# Altium project STM32F7_ExpansionBoard.PrjPcb (part 2 of 2)

## Sheet Power.SchDoc: Power
size A4; SheetNumber: 1; SheetSize: A4
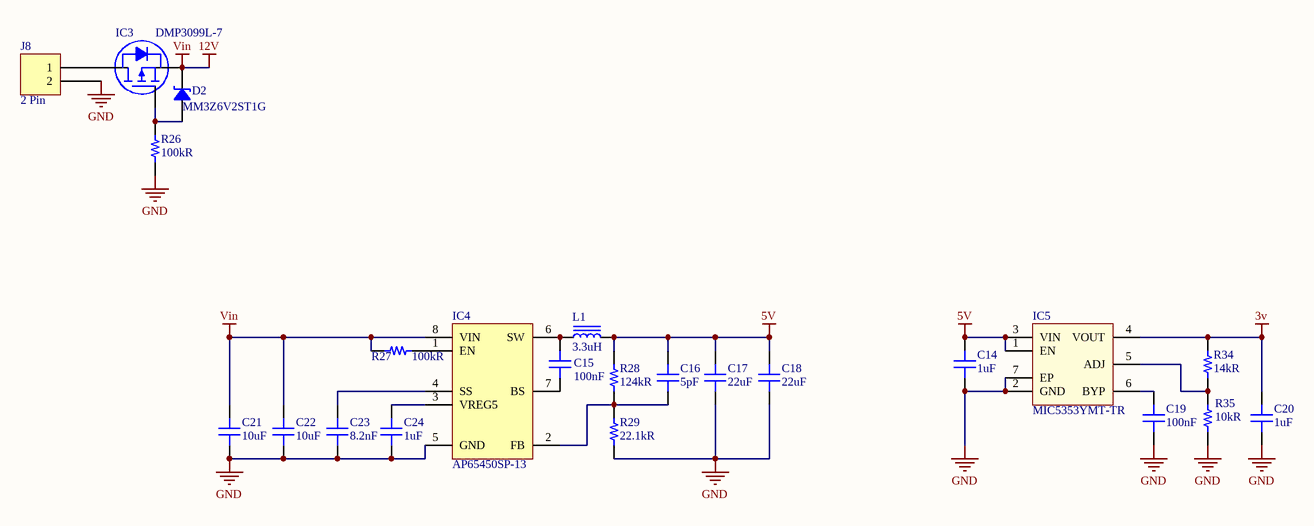
[diagram p3: Power.SchDoc]

### Parts
C14  1uF  [CAP 0603/1608]
C15  100nF  [CAP 0603/1608]
C16  5pF  [CAP 0603/1608]
C17  22uF  [CAP 0603/1608]
C18  22uF  [CAP 0603/1608]
C19  100nF  [CAP 0603/1608]
C20  1uF  [CAP 0603/1608]
C21  10uF  [CAP 0603/1608]
C22  10uF  [CAP 0603/1608]
C23  8.2nF  [CAP 0603/1608]
C24  1uF  [CAP 0603/1608]
D2  MM3Z6V2ST1G  [SOD323]
IC3  DMP3099L-7  [DIODES SOT-23-3]
IC4  AP65450SP-13  [DIODES SO-8EP]
IC5  MIC5353YMT-TR  [MICREL MLF-6 1.6x1.6MM]
J8  2 Pin  [TE 282834-2]  (no BOM)
L1  3.3uH  [MURATA 1264EY-4R7M=P3]
R26  100kR  [RES 0603/1608]
R27  100kR  [RES 0603/1608]
R28  124kR  [RES 0603/1608]
R29  22.1kR  [RES 0603/1608]
R34  14kR  [RES 0603/1608]
R35  10kR  [RES 0603/1608]

### Nets
3v: C20.2 IC5.4(VOUT) R34.2
5V: C14.2 C16.2 C17.2 C18.2 IC5.1(EN) IC5.3(VIN) L1.2 R28.1
12V: C21.2 C22.2 D2.2 IC3.2(S) IC4.8(VIN) R27.1  [also labelled Vin]
GND: C14.1 C17.1 C18.1 C19.1 C20.1 C21.1 C22.1 C23.1 C24.1 IC4.5(GND) IC5.2(GND) IC5.7(EP) J8.2 R26.1 R29.2 R35.2
NetC15_1: C15.1 IC4.6(SW) L1.1
NetC15_2: C15.2 IC4.7(BS)
NetC16_1: C16.1 IC4.2(FB) R28.2 R29.1
NetC19_2: C19.2 IC5.6(BYP)
NetC23_2: C23.2 IC4.4(SS)
NetC24_2: C24.2 IC4.3(VREG5)
NetD2_1: D2.1 IC3.1(G) R26.2
NetIC3_3: IC3.3(D) J8.1
NetIC4_1: IC4.1(EN) R27.2
NetIC5_5: IC5.5(ADJ) R34.1 R35.1

### Notes on the sheet
- Title:
- Size:
- Project:
- Revision:
- Sheet
- of
- Date:
- YıLDıZ IoT
- Elperek Mahallesi
- Saray Sokak, No:12
- SAKARYA / TURKEY
- File:

### Library data of the parts
C14 C20 C24 = Capacitor - Ceramic: Ceramic, SMT Capacitor; Manufacturer: Samsung; Manufacturer Part Number: CL10A105KP8NNNC; Tolerance: 10%; Voltage Rating: 10V; Dielectric: X5R; Supplier 1: Digi-Key; Supplier Part Number 1: 1276-1182-1-ND; Stock 1: 4590831; Pricing 1: 1 = 0,10000, 10 = 0,03800, 100 = 0,01680, 500 = 0,01200, 1000 = 0,00943 (USD); RoHS: Yes; Mount: Surface Mount; Case/Package: 0603; Case Code (Metric): 1608; Case Code (Imperial): 0603; Contact Plating: Tin; Min Operating Temperature: -55°C; Max Operating Temperature: 85°C; Packaging: Tape and Reel; Package Quantity: 1; Capacitance: 1uF; Voltage: 10V; Length: 1.6mm; Height: 0.8mm; Width: 0.031inch; Thickness: 0.035inch; Depth: 0.8mm; Radiation Hardening: No; ComponentLink1URL: https://datasheet.ciiva.com/15195/getdatasheetpartid-358616-15195708.pdf?src-supplier=Verical; ComponentLink1Description: https://datasheet.ciiva.com/15195/getdatasheetpartid-358616-15195708.pdf?src-supplier=Verical; ComponentLink2URL: https://datasheet.ciiva.com/16358/cl05b104kq5nnnc-16358431.pdf?src-supplier=Future+Electronics; ComponentLink2Description: https://datasheet.ciiva.com/16358/cl05b104kq5nnnc-16358431.pdf?src-supplier=Future+Electronics
C15 C19 = Capacitor - Ceramic: Ceramic, SMT Capacitor; Manufacturer: Samsung; Manufacturer Part Number: CL10B104JB8NNNC; Tolerance: 5%; Voltage Rating: 50V; Dielectric: X7R; Supplier 1: Digi-Key; Supplier Part Number 1: 1276-1033-1-ND; Stock 1: 223594; Pricing 1: 1 = 0,10000, 10 = 0,05300, 100 = 0,02350, 500 = 0,01680, 1000 = 0,01320 (USD); RoHS: Yes; Mount: Surface Mount; Case/Package: 0603; Case Code (Metric): 1608; Case Code (Imperial): 0603; Material: Ceramic; Contact Plating: Tin; Min Operating Temperature: -55°C; Max Operating Temperature: 125°C; Packaging: Tape and Reel; Package Quantity: 1; Capacitance: 100nF; Voltage: 50V; Length: 1.6mm; Height: 0.8mm; Width: 0.031inch; Thickness: 0.035inch; Depth: 0.8mm; Radiation Hardening: No; ComponentLink1URL: https://media.digikey.com/pdf/Data%20Sheets/Samsung%20PDFs/CL_Series_MLCC_ds.pdf?src-supplier=Digi-Key; ComponentLink1Description: https://media.digikey.com/pdf/Data%20Sheets/Samsung%20PDFs/CL_Series_MLCC_ds.pdf?src-supplier=Digi-Key; ComponentLink2URL: https://www.verical.com/server-webapp/html/getDatasheet?partID=359321&src-supplier=Verical; ComponentLink2Description: https://www.verical.com/server-webapp/html/getDatasheet?partID=359321&src-supplier=Verical; ComponentLink3URL: http://www1.futureelectronics.com/doc/SAMSUNG/CL10B104JB8NNNC.pdf?src-supplier=Future+Electronics; ComponentLink3Description: http://www1.futureelectronics.com/doc/SAMSUNG/CL10B104JB8NNNC.pdf?src-supplier=Future+Electronics; ComponentLink4URL: https://produktinfo.conrad.com/datenblaetter/450000-474999/456613-da-01-en-VS_KONDENSATOR_0603.pdf?src-supplier=Conrad; ComponentLink4Description: https://produktinfo.conrad.com/datenblaetter/450000-474999/456613-da-01-en-VS_KONDENSATOR_0603.pdf?src-supplier=Conrad
C16 = Capacitor - Ceramic: Ceramic, SMT Capacitor; Manufacturer: Samsung; Manufacturer Part Number: CL10C050BB8NNNC; Voltage Rating: 50V; Dielectric: C0G; Supplier 1: Digi-Key; Supplier Part Number 1: 1276-2129-1-ND; Stock 1: 129045; Pricing 1: 1 = 0,10000, 10 = 0,06800, 100 = 0,03010, 500 = 0,02148, 1000 = 0,01688 (USD); RoHS: Yes; Mount: Surface Mount; Case/Package: 0603; Case Code (Imperial): 0603; Case Code (Metric): 1608; Min Operating Temperature: -55°C; Max Operating Temperature: 125°C; Package Quantity: 1; Packaging: Tape and Reel; Capacitance: 5pF; Length: 1.6mm; Height: 0.8mm; Width: 0.031inch; Thickness: 0.035inch; Depth: 0.8mm; Radiation Hardening: No; ComponentLink1URL: https://datasheet.ciiva.com/25724/cl10c050bb8nnnc-25724229.pdf?src-supplier=Digi-Key; ComponentLink1Description: https://datasheet.ciiva.com/25724/cl10c050bb8nnnc-25724229.pdf?src-supplier=Digi-Key; ComponentLink2URL: https://datasheet.ciiva.com/16214/cl05b104kq5nnnc-16214485.pdf?src-supplier=Future+Electronics; ComponentLink2Description: https://datasheet.ciiva.com/16214/cl05b104kq5nnnc-16214485.pdf?src-supplier=Future+Electronics
C17 C18 = Capacitor - Ceramic: Ceramic, SMT Capacitor; Manufacturer: Samsung; Manufacturer Part Number: CL10A226MPCNUBE; Voltage Rating: 10V; Tolerance: 20%; Supplier 1: Digi-Key; Supplier Part Number 1: 1276-6504-1-ND; Stock 1: 739808; Pricing 1: 1 = 0,38000, 10 = 0,26200, 100 = 0,15740, 500 = 0,11804, 1000 = 0,09967 (USD); RoHS: Yes; Mount: Surface Mount; Case/Package: 0603; Case Code (Metric): 1608; Case Code (Imperial): 0603; Min Operating Temperature: -55°C; Max Operating Temperature: 85°C; Packaging: Tape and Reel; Capacitance: 22uF; Length: 0.063inch; Width: 0.031inch; Thickness: 0.037inch; ComponentLink1URL: http://www.samsungsem.com/kr/support/product-search/mlcc/CL10A226MPCNUBE.jsp?src-supplier=Digi-Key; ComponentLink1Description: http://www.samsungsem.com/kr/support/product-search/mlcc/CL10A226MPCNUBE.jsp?src-supplier=Digi-Key
C21 C22 = Capacitor - Ceramic: Ceramic, SMT Capacitor; Manufacturer: Samsung; Manufacturer Part Number: CL10A106MQ8NNNC; Tolerance: 20%; Voltage Rating: 6.3V; Dielectric: X5R; Supplier 1: Digi-Key; Supplier Part Number 1: 1276-1119-1-ND; Stock 1: 4408315; Pricing 1: 1 = 0,15000, 10 = 0,11000, 100 = 0,05150, 500 = 0,03614, 1000 = 0,02992 (USD); RoHS: Yes; Mount: Surface Mount; Case/Package: 0603; Case Code (Metric): 1608; Case Code (Imperial): 0603; Contact Plating: Tin; Min Operating Temperature: -55°C; Max Operating Temperature: 85°C; Package Quantity: 1; Packaging: Tape and Reel; Capacitance: 10uF; Voltage: 6.3V; Length: 1.6mm; Height: 0.8mm; Width: 0.031inch; Thickness: 0.035inch; Depth: 0.8mm; Radiation Hardening: No; ComponentLink1URL: https://datasheet.ciiva.com/25798/cl10a106mq8nnnc-25798320.pdf?src-supplier=Digi-Key; ComponentLink1Description: https://datasheet.ciiva.com/25798/cl10a106mq8nnnc-25798320.pdf?src-supplier=Digi-Key; ComponentLink2URL: https://datasheet.ciiva.com/26838/getdatasheetpartid-357557-26838347.pdf?src-supplier=Verical; ComponentLink2Description: https://datasheet.ciiva.com/26838/getdatasheetpartid-357557-26838347.pdf?src-supplier=Verical; ComponentLink3URL: https://datasheet.ciiva.com/16437/cl05b104kq5nnnc-16437327.pdf?src-supplier=Future+Electronics; ComponentLink3Description: https://datasheet.ciiva.com/16437/cl05b104kq5nnnc-16437327.pdf?src-supplier=Future+Electronics
C23 = Capacitor - Ceramic: Ceramic, SMT Capacitor; Manufacturer: Walsin Technologies; Manufacturer Part Number: 0603B822K500CT; Dielectric: X7R; Tolerance: 10%; Supplier 1: Digi-Key; Supplier Part Number 1: 1292-1465-1-ND; Stock 1: 48948; Pricing 1: 1 = 0,10000, 10 = 0,04500, 100 = 0,02010, 500 = 0,01436, 1000 = 0,01128 (USD); RoHS: Yes; Case/Package: 0603; Min Operating Temperature: -55°C; Max Operating Temperature: 125°C; Packaging: Tape and Reel; Capacitance: 8.2nF; Length: 1.6mm; Depth: 0.8mm; Radiation Hardening: No; ComponentLink1URL: http://components.arrow.com/part/dataview/0323_00656732?src-supplier=Arrow+Europe; ComponentLink1Description: http://components.arrow.com/part/dataview/0323_00656732?src-supplier=Arrow+Europe; ComponentLink2URL: https://www.verical.com/server-webapp/html/getDatasheet?partID=414331&src-supplier=Verical; ComponentLink2Description: https://www.verical.com/server-webapp/html/getDatasheet?partID=414331&src-supplier=Verical
D2 = MM3Z6V2ST1G: DIODE ZENER 6.2V 300MW SOD323; Manufacturer: ON Semiconductor; Material: Plastic; Element Configuration: Single; Impedance: 10R; Max Reverse Leakage Current: 3uA; Tolerance: 2%; Test Current: 5mA; Max Power Dissipation: 200mW; ESD Protection: Yes; Zener Current: 10mA; Forward Voltage: 900mV; ComponentLink1Description: Datasheet; ComponentLink1URL: https://www.onsemi.com/pub/Collateral/MM3Z2V4ST1-D.PDF; ComponentLink2Description: DigiKey Link; ComponentLink2URL: http://digikey.com/product-detail/en/on-semiconductor/MM3Z6V2ST1G/MM3Z6V2ST1GOSCT-ND/2705115; Supplier 1: Digi-Key; Supplier Part Number 1: MM3Z6V2ST1GOSCT-ND; Manufacturer Part Number: MM3Z6V2ST1G; Stock 1: 67524; Pricing 1: 1 = 0,13000, 10 = 0,11800, 25 = 0,11240, 100 = 0,04950, 250 = 0,04752, 500 = 0,03888, 1000 = 0,02700 (USD); RoHS: Yes; Case/Package: SOD-323-2; Number of Pins: 2; Contact Plating: Tin,Matte; Min Operating Temperature: -65°C; Max Operating Temperature: 150°C; Zener Voltage: 6.2V; Package Quantity: 3000; Packaging: Tape and Reel; Voltage Rating (DC): 6.2V; Power Rating: 200mW; Power Dissipation: 200mW; Voltage Tolerance: 2%; Working Voltage: 6.2V; Peak Reverse Current: 3uA; Length: 1.8mm; Height: 1mm; Width: 1.35mm; Radiation Hardening: No; Lead Free: Lead Free; REACH SVHC: No SVHC; ComponentLink3URL: https://datasheet.ciiva.com/16292/mm3z6v2st1g-16292653.pdf?src-supplier=Future+Electronics; ComponentLink3Description: https://datasheet.ciiva.com/16292/mm3z6v2st1g-16292653.pdf?src-supplier=Future+Electronics; ComponentLink4URL: https://datasheet.ciiva.com/899/mm3z2v4st1-d-899825.pdf?src-supplier=Digi-Key; ComponentLink4Description: https://datasheet.ciiva.com/899/mm3z2v4st1-d-899825.pdf?src-supplier=Digi-Key; ComponentLink5URL: https://datasheet.ciiva.com/899/mm3z2v4st1-d-899826.pdf?src-supplier=Digi-Key; ComponentLink5Description: https://datasheet.ciiva.com/899/mm3z2v4st1-d-899826.pdf?src-supplier=Digi-Key; ComponentLink6URL: https://datasheet.ciiva.com/22626/1878251-22626917.pdf?src-supplier=Element14; ComponentLink6Description: https://datasheet.ciiva.com/22626/1878251-22626917.pdf?src-supplier=Element14; ComponentLink7URL: https://datasheet.ciiva.com/16473/mm3z2v4st1-d-16473527.pdf?src-supplier=Avnet+Asia; ComponentLink7Description: https://datasheet.ciiva.com/16473/mm3z2v4st1-d-16473527.pdf?src-supplier=Avnet+Asia; ComponentLink8URL: https://datasheet.ciiva.com/22626/1878251-22626919.pdf?src-supplier=Element14; ComponentLink8Description: https://datasheet.ciiva.com/22626/1878251-22626919.pdf?src-supplier=Element14; ComponentLink9URL: https://datasheet.ciiva.com/10637/mm3z2v4st1-d-10637848.pdf?src-supplier=Avnet; ComponentLink9Description: https://datasheet.ciiva.com/10637/mm3z2v4st1-d-10637848.pdf?src-supplier=Avnet; ComponentLink10URL: https://datasheet.ciiva.com/899/mm3z2v4st1-d-899827.pdf?src-supplier=Digi-Key; ComponentLink10Description: https://datasheet.ciiva.com/899/mm3z2v4st1-d-899827.pdf?src-supplier=Digi-Key
IC3 = DMP3099L-7: MOSFET P-CH 30V SOT23; Manufacturer: Diodes; Drain to Source Voltage (Vdss): -30V; Number of Channels: 1; Continuous Drain Current (ID): 3.8A; Max Power Dissipation: 1.08W; Turn-On Delay Time: 4.8ns; Turn-Off Delay Time: 31ns; Fall Time: 15ns; Drain to Source Resistance: 65mR; Threshold Voltage: -2.1V; Rise Time: 5ns; Input Capacitance: 563pF; Element Configuration: Single; Gate to Source Voltage (Vgs): 20V; ComponentLink1Description: Datasheet; ComponentLink1URL: https://www.diodes.com/assets/Datasheets/DMP3099L.pdf; ComponentLink2Description: DigiKey Link; ComponentLink2URL: http://digikey.com/product-detail/en/diodes-incorporated/DMP3099L-7/DMP3099L-7DICT-ND/5218217; ComponentLink3URL: http://www.farnell.com/datasheets/2040103.pdf?src-supplier=Farnell; ComponentLink3Description: http://www.farnell.com/datasheets/2040103.pdf?src-supplier=Farnell; ComponentLink4URL: http://www.mouser.com/ds/2/115/DMP3099L-266220.pdf?src-supplier=Mouser; ComponentLink4Description: http://www.mouser.com/ds/2/115/DMP3099L-266220.pdf?src-supplier=Mouser; ComponentLink5URL: http://www.alliedelec.com/m/d/a7453f83181edfde31570147b9d1ef2f.pdf?src-supplier=Allied+Electronics; ComponentLink5Description: http://www.alliedelec.com/m/d/a7453f83181edfde31570147b9d1ef2f.pdf?src-supplier=Allied+Electronics; ComponentLink6URL: http://www.diodes.com/datasheets/DMP3099L.pdf?src-supplier=Avnet; ComponentLink6Description: http://www.diodes.com/datasheets/DMP3099L.pdf?src-supplier=Avnet; ComponentLink7URL: http://www.diodes.com/datasheets/DMP3099L.pdf?src-supplier=Avnet+Asia; ComponentLink7Description: http://www.diodes.com/datasheets/DMP3099L.pdf?src-supplier=Avnet+Asia; ComponentLink8URL: https://www.diodes.com/assets/Datasheets/DMP3099L.pdf?src-supplier=Digi-Key; ComponentLink8Description: https://www.diodes.com/assets/Datasheets/DMP3099L.pdf?src-supplier=Digi-Key; ComponentLink9URL: http://www.farnell.com/datasheets/2040103.pdf?src-supplier=Newark; ComponentLink9Description: http://www.farnell.com/datasheets/2040103.pdf?src-supplier=Newark; ComponentLink10URL: http://www.farnell.com/datasheets/2040103.pdf?src-supplier=Element14; ComponentLink10Description: http://www.farnell.com/datasheets/2040103.pdf?src-supplier=Element14; ComponentLink11URL: http://www.diodes.com/datasheets/DMP3099L.pdf?src-supplier=Digi-Key; ComponentLink11Description: http://www.diodes.com/datasheets/DMP3099L.pdf?src-supplier=Digi-Key; Supplier 1: Digi-Key; Supplier Part Number 1: DMP3099L-7DICT-ND; Manufacturer Part Number: DMP3099L-7; Stock 1: 60343; Pricing 1: 1 = 0,33000, 10 = 0,24200, 25 = 0,21200, 100 = 0,11510, 250 = 0,11452, 500 = 0,09394, 1000 = 0,06969 (USD); RoHS: Yes; Mount: Surface Mount; Case/Package: SOT-23; Number of Pins: 3; Weight: 0.000282oz; Contact Plating: Tin,Matte; Min Operating Temperature: -55°C; Max Operating Temperature: 150°C; Package Quantity: 3000; Packaging: Tape and Reel; Rds On Max: 65mR; Length: 3mm; Height: 1.1mm; Width: 1.4mm; Radiation Hardening: No; REACH SVHC: No SVHC; Lead Free: Lead Free
IC4 = DIODES AP65450: Manufacturer: Diodes; Output Voltage: 6V; Operating Supply Current: 900uA; Min Supply Voltage: 4.5V; Max Output Current: 4A; Output Type: Adjustable; Output Configuration: Positive; Operating Supply Voltage: 18V; Number of Outputs: 1; Min Output Voltage: 760mV; Switching Frequency: 650kHz; Synchronous Rectifier: Yes; Supplier 1: Digi-Key; Supplier Part Number 1: AP65450SP-13DICT-ND; Manufacturer Part Number: AP65450SP-13; Stock 1: 3355; Pricing 1: 1 = 0,83000, 10 = 0,73300, 25 = 0,68880, 100 = 0,52220, 250 = 0,44440, 500 = 0,42218, 1000 = 0,32219 (USD); RoHS: Yes; Mount: Surface Mount; Case/Package: SOIC; Number of Pins: 8; Contact Plating: Tin,Matte; Min Operating Temperature: -40°C; Max Operating Temperature: 85°C; Package Quantity: 2500; Packaging: Tape and Reel; Min Input Voltage: 4.5V; Max Input Voltage: 18V; Max Output Voltage: 6V; Output Current: 4A; Lead Free: Lead Free; ComponentLink1URL: http://www.mouser.com/ds/2/115/AP65450-515037.pdf?src-supplier=Mouser; ComponentLink1Description: http://www.mouser.com/ds/2/115/AP65450-515037.pdf?src-supplier=Mouser; ComponentLink2URL: https://www.diodes.com/assets/Datasheets/AP65450.pdf?src-supplier=Digi-Key; ComponentLink2Description: https://www.diodes.com/assets/Datasheets/AP65450.pdf?src-supplier=Digi-Key; ComponentLink3URL: http://diodes.com/datasheets/AP65450.pdf?src-supplier=Avnet; ComponentLink3Description: http://diodes.com/datasheets/AP65450.pdf?src-supplier=Avnet
IC5 = MICROCHIP MIC5353: Integrated Circuit; ComponentLink1URL: http://www.farnell.com/datasheets/2245202.pdf?src-supplier=Farnell; ComponentLink1Description: http://www.farnell.com/datasheets/2245202.pdf?src-supplier=Farnell; ComponentLink2URL: http://www.microchip.com/mymicrochip/filehandler.aspx?ddocname=en579989&src-supplier=Digi-Key; ComponentLink2Description: http://www.microchip.com/mymicrochip/filehandler.aspx?ddocname=en579989&src-supplier=Digi-Key; ComponentLink3URL: http://www.farnell.com/datasheets/1692673.pdf?src-supplier=Element14; ComponentLink3Description: http://www.farnell.com/datasheets/1692673.pdf?src-supplier=Element14; Supplier 1: Digi-Key; Supplier Part Number 1: 576-3681-1-ND; Manufacturer: Microchip; Manufacturer Part Number: MIC5353YMT-TR; Stock 1: 1004; Pricing 1: 1 = 0,34000, 25 = 0,28000, 100 = 0,26000 (USD); RoHS: Yes; ComponentLink4URL: https://datasheet.ciiva.com/2049/mic5353-2049344.pdf?src-supplier=Digi-Key; ComponentLink4Description: https://datasheet.ciiva.com/2049/mic5353-2049344.pdf?src-supplier=Digi-Key; ComponentLink5URL: https://datasheet.ciiva.com/2049/mic5353-2049342.pdf?src-supplier=Digi-Key; ComponentLink5Description: https://datasheet.ciiva.com/2049/mic5353-2049342.pdf?src-supplier=Digi-Key; ComponentLink6URL: https://datasheet.ciiva.com/2049/mic5353-2049343.pdf?src-supplier=Digi-Key; ComponentLink6Description: https://datasheet.ciiva.com/2049/mic5353-2049343.pdf?src-supplier=Digi-Key
L1 = Inductor Iron Core: Manufacturer: Murata; Manufacturer Part Number: 1264EY-3R3N=P3; Core Material: Ferrite; Tolerance: 30%; Current Rating: 6.5A; Shielding: Shielded; DC Resistance (DCR): 25.2mR; Test Frequency: 100kHz; ComponentLink1URL: http://www.toko.co.jp/products/pdf/inductors/dg6050c.pdf?src-supplier=Avnet; ComponentLink1Description: http://www.toko.co.jp/products/pdf/inductors/dg6050c.pdf?src-supplier=Avnet; ComponentLink2URL: http://www.toko.co.jp/products/pdf/inductors/dg6050c.pdf?src-supplier=Digi-Key; ComponentLink2Description: http://www.toko.co.jp/products/pdf/inductors/dg6050c.pdf?src-supplier=Digi-Key; Supplier 1: Digi-Key; Supplier Part Number 1: 490-10821-1-ND; Stock 1: 442; Pricing 1: 1 = 0,51000, 10 = 0,44300, 100 = 0,31630, 500 = 0,26566 (USD); RoHS: Yes; Mount: Surface Mount; Case/Package: Nonstandard; Packaging: Tape and Reel; Composition: Wirewound; Inductance: 3.3uH; Length: 0.248inch; Width: 0.248inch; Height - Seated (Max): 0.198inch
R26 R27 = Resistor_Chip: Ceramic, SMT Capacitor; Manufacturer: Susumu; Manufacturer Part Number: RR0816P-104-D; Max Power Dissipation: 63mW; Voltage Rating (DC): 75V; Tolerance: 0.5%; Temperature Coefficient: 25ppm/°C; Supplier 1: Digi-Key; Supplier Part Number 1: RR08P100KDCT-ND; Pricing 1: 1 = 0,10000, 10 = 0,09300, 100 = 0,03580, 1000 = 0,01575, 2500 = 0,01360 (USD); RoHS: Yes; Case/Package: 0603; Number of Pins: 2; Case Code (Imperial): 0603; Case Code (Metric): 1608; Min Operating Temperature: -55°C; Max Operating Temperature: 125°C; Power Rating: 63mW; Voltage Rating: 75V; Packaging: Tape and Reel; Resistance: 100kR; Package Quantity: 1; Termination: SMD/SMT; Composition: Thin Film; Number of Terminations: 2; Working Voltage: 75V; Length: 1.6mm; Height: 0.4mm; Width: 0.8mm; Depth: 0.8mm; Lead Free: Lead Free; REACH SVHC: Unknown; ComponentLink1URL: https://datasheet.ciiva.com/11820/0900766b80808d64-11820638.pdf?src-supplier=RSComponents; ComponentLink1Description: https://datasheet.ciiva.com/11820/0900766b80808d64-11820638.pdf?src-supplier=RSComponents; ComponentLink2URL: https://datasheet.ciiva.com/7984/87330-7984341.pdf?src-supplier=Element14; ComponentLink2Description: https://datasheet.ciiva.com/7984/87330-7984341.pdf?src-supplier=Element14; ComponentLink3URL: https://datasheet.ciiva.com/2487/rr-data-sheet-2487067.pdf?src-supplier=Digi-Key; ComponentLink3Description: https://datasheet.ciiva.com/2487/rr-data-sheet-2487067.pdf?src-supplier=Digi-Key; ComponentLink4URL: https://datasheet.ciiva.com/2487/rr-data-sheet-2487068.pdf?src-supplier=Digi-Key; ComponentLink4Description: https://datasheet.ciiva.com/2487/rr-data-sheet-2487068.pdf?src-supplier=Digi-Key; ComponentLink5URL: https://datasheet.ciiva.com/2487/rr-data-sheet-2487069.pdf?src-supplier=Digi-Key; ComponentLink5Description: https://datasheet.ciiva.com/2487/rr-data-sheet-2487069.pdf?src-supplier=Digi-Key
  R26: Stock 1: 70051
  R27: Stock 1: 69727
R28 = Resistor_Chip: Ceramic, SMT Capacitor; Manufacturer: Stackpole Electronics; Manufacturer Part Number: RMCF0603FT124K; Max Power Dissipation: 100mW; Temperature Coefficient: 100ppm/°C; Tolerance: 1%; ComponentLink1URL: https://datasheet.ciiva.com/11820/0900766b80808d64-11820638.pdf?src-supplier=RSComponents; ComponentLink1Description: https://datasheet.ciiva.com/11820/0900766b80808d64-11820638.pdf?src-supplier=RSComponents; ComponentLink2URL: https://datasheet.ciiva.com/7984/87330-7984341.pdf?src-supplier=Element14; ComponentLink2Description: https://datasheet.ciiva.com/7984/87330-7984341.pdf?src-supplier=Element14; ComponentLink3URL: https://datasheet.ciiva.com/2487/rr-data-sheet-2487067.pdf?src-supplier=Digi-Key; ComponentLink3Description: https://datasheet.ciiva.com/2487/rr-data-sheet-2487067.pdf?src-supplier=Digi-Key; ComponentLink4URL: https://datasheet.ciiva.com/2487/rr-data-sheet-2487068.pdf?src-supplier=Digi-Key; ComponentLink4Description: https://datasheet.ciiva.com/2487/rr-data-sheet-2487068.pdf?src-supplier=Digi-Key; ComponentLink5URL: https://datasheet.ciiva.com/2487/rr-data-sheet-2487069.pdf?src-supplier=Digi-Key; ComponentLink5Description: https://datasheet.ciiva.com/2487/rr-data-sheet-2487069.pdf?src-supplier=Digi-Key; Supplier 1: Digi-Key; Supplier Part Number 1: RMCF0603FT124KCT-ND; Stock 1: 39767; Pricing 1: 1 = 0,10000, 10 = 0,01600, 100 = 0,00650, 1000 = 0,00292, 2500 = 0,00253 (USD); RoHS: Yes; Mount: Surface Mount; Case/Package: 0603; Case Code (Metric): 1608; Contact Plating: Tin,Matte; Case Code (Imperial): 0603; Min Operating Temperature: -55°C; Max Operating Temperature: 155°C; Features: Automotive AEC-Q200; Composition: Thick Film; Number of Terminations: 2; Military Standard: Not; Resistance: 124kR; Packaging: Tape and Reel; Length: 0.061inch; Height: 0.022inch; Depth: 0.8mm; Width: 0.031inch; Radiation Hardening: No; ComponentLink6URL: https://www.verical.com/server-webapp/html/getDatasheet?partID=371756&src-supplier=Verical; ComponentLink6Description: https://www.verical.com/server-webapp/html/getDatasheet?partID=371756&src-supplier=Verical; ComponentLink7URL: https://www.seielect.com/Catalog/SEI-RMCF_RMCP.pdf?src-supplier=Digi-Key; ComponentLink7Description: https://www.seielect.com/Catalog/SEI-RMCF_RMCP.pdf?src-supplier=Digi-Key; ComponentLink8URL: https://www.seielect.com/catalog/SEI-Packaging.pdf?src-supplier=Digi-Key; ComponentLink8Description: https://www.seielect.com/catalog/SEI-Packaging.pdf?src-supplier=Digi-Key; ComponentLink9URL: http://components.arrow.com/part/dataview/40961222S9798425N1174?src-supplier=Arrow; ComponentLink9Description: http://components.arrow.com/part/dataview/40961222S9798425N1174?src-supplier=Arrow; ComponentLink10URL: https://www.seielect.com/catalog/SEI-RMCF_RMCP.pdf?src-supplier=Avnet; ComponentLink10Description: https://www.seielect.com/catalog/SEI-RMCF_RMCP.pdf?src-supplier=Avnet
R29 = Resistor_Chip: Ceramic, SMT Capacitor; Manufacturer: Stackpole Electronics; Manufacturer Part Number: RMCF0603FT22K1; Max Power Dissipation: 100mW; Temperature Coefficient: 100ppm/°C; Tolerance: 1%; ComponentLink1URL: https://datasheet.ciiva.com/11820/0900766b80808d64-11820638.pdf?src-supplier=RSComponents; ComponentLink1Description: https://datasheet.ciiva.com/11820/0900766b80808d64-11820638.pdf?src-supplier=RSComponents; ComponentLink2URL: https://datasheet.ciiva.com/7984/87330-7984341.pdf?src-supplier=Element14; ComponentLink2Description: https://datasheet.ciiva.com/7984/87330-7984341.pdf?src-supplier=Element14; ComponentLink3URL: https://datasheet.ciiva.com/2487/rr-data-sheet-2487067.pdf?src-supplier=Digi-Key; ComponentLink3Description: https://datasheet.ciiva.com/2487/rr-data-sheet-2487067.pdf?src-supplier=Digi-Key; ComponentLink4URL: https://datasheet.ciiva.com/2487/rr-data-sheet-2487068.pdf?src-supplier=Digi-Key; ComponentLink4Description: https://datasheet.ciiva.com/2487/rr-data-sheet-2487068.pdf?src-supplier=Digi-Key; ComponentLink5URL: https://datasheet.ciiva.com/2487/rr-data-sheet-2487069.pdf?src-supplier=Digi-Key; ComponentLink5Description: https://datasheet.ciiva.com/2487/rr-data-sheet-2487069.pdf?src-supplier=Digi-Key; Supplier 1: Digi-Key; Supplier Part Number 1: RMCF0603FT22K1CT-ND; Stock 1: 555240; Pricing 1: 1 = 0,10000, 10 = 0,01600, 100 = 0,00650, 1000 = 0,00292, 2500 = 0,00253 (USD); RoHS: Yes; Mount: Surface Mount; Case/Package: 0603; Contact Plating: Tin,Matte; Case Code (Imperial): 0603; Case Code (Metric): 1608; Min Operating Temperature: -55°C; Max Operating Temperature: 155°C; Features: Automotive AEC-Q200; Package Quantity: 1; Composition: Thick Film; Number of Terminations: 2; Military Standard: Not; Packaging: Tape and Reel; Resistance: 22.1kR; Power Rating: 100mW; Length: 0.061inch; Height: 0.022inch; Depth: 0.8mm; Width: 0.031inch; Radiation Hardening: No; Lead Free: Lead Free; ComponentLink6URL: http://components.arrow.com/part/dataview/40960961S7171997N1174?src-supplier=Arrow; ComponentLink6Description: http://components.arrow.com/part/dataview/40960961S7171997N1174?src-supplier=Arrow; ComponentLink7URL: https://www.verical.com/server-webapp/html/getDatasheet?partID=375344&src-supplier=Verical; ComponentLink7Description: https://www.verical.com/server-webapp/html/getDatasheet?partID=375344&src-supplier=Verical; ComponentLink8URL: https://www.seielect.com/catalog/SEI-Packaging.pdf?src-supplier=Digi-Key; ComponentLink8Description: https://www.seielect.com/catalog/SEI-Packaging.pdf?src-supplier=Digi-Key; ComponentLink9URL: https://www.seielect.com/Catalog/SEI-RMCF_RMCP.pdf?src-supplier=Digi-Key; ComponentLink9Description: https://www.seielect.com/Catalog/SEI-RMCF_RMCP.pdf?src-supplier=Digi-Key; ComponentLink10URL: https://www.seielect.com/catalog/SEI-RMCF_RMCP.pdf?src-supplier=Avnet; ComponentLink10Description: https://www.seielect.com/catalog/SEI-RMCF_RMCP.pdf?src-supplier=Avnet; ComponentLink11URL: http://www.seielect.com/Catalog/SEI-RMC.pdf?src-supplier=Future+Electronics; ComponentLink11Description: http://www.seielect.com/Catalog/SEI-RMC.pdf?src-supplier=Future+Electronics
R34 = Resistor_Chip: Ceramic, SMT Capacitor; Manufacturer: Yageo; Manufacturer Part Number: RC0603FR-0714KL; Tolerance: 1%; Power Rating: 100mW; Voltage Rating: 75V; Temperature Coefficient: 100ppm/°C; Voltage Rating (DC): 50V; Supplier 1: Digi-Key; Supplier Part Number 1: 311-14.0KHRCT-ND; Stock 1: 622097; Pricing 1: 1 = 0,10000, 10 = 0,02300, 100 = 0,00940, 1000 = 0,00421, 2500 = 0,00366 (USD); RoHS: Yes; Case/Package: 0603; Weight: 7.1E-05oz; Case Code (Metric): 1608; Case Code (Imperial): 0603; Min Operating Temperature: -55°C; Max Operating Temperature: 155°C; Resistance: 14kR; Packaging: Tape and Reel; Package Quantity: 1; Max Power Dissipation: 100mW; Features: Moisture Resistant; Composition: Thick Film; Number of Terminations: 2; Termination: SMD/SMT; Military Standard: Not; Length: 1.6mm; Height: 0.022inch; Width: 0.031inch; Depth: 0.8mm; Lead Free: Lead Free; ComponentLink1URL: https://datasheet.ciiva.com/15189/getdatasheetpartid-325152-15189610.pdf?src-supplier=Verical; ComponentLink1Description: https://datasheet.ciiva.com/15189/getdatasheetpartid-325152-15189610.pdf?src-supplier=Verical; ComponentLink2URL: https://datasheet.ciiva.com/2455/pyu-r-int-thick-7-2455089.pdf?src-supplier=Digi-Key; ComponentLink2Description: https://datasheet.ciiva.com/2455/pyu-r-int-thick-7-2455089.pdf?src-supplier=Digi-Key; ComponentLink3URL: https://datasheet.ciiva.com/2455/pyu-r-int-thick-7-2455090.pdf?src-supplier=Digi-Key; ComponentLink3Description: https://datasheet.ciiva.com/2455/pyu-r-int-thick-7-2455090.pdf?src-supplier=Digi-Key; ComponentLink4URL: https://datasheet.ciiva.com/2455/pyu-r-int-thick-7-2455091.pdf?src-supplier=Digi-Key; ComponentLink4Description: https://datasheet.ciiva.com/2455/pyu-r-int-thick-7-2455091.pdf?src-supplier=Digi-Key
R35 = Resistor_Chip: Ceramic, SMT Capacitor; Manufacturer: Stackpole Electronics; Manufacturer Part Number: RNCP0603FTD10K0; Tolerance: 1%; Max Power Dissipation: 125mW; Temperature Coefficient: 100ppm/°C; Supplier 1: Digi-Key; Supplier Part Number 1: RNCP0603FTD10K0CT-ND; Stock 1: 183083; Pricing 1: 1 = 0,10000, 10 = 0,06700, 100 = 0,02730, 1000 = 0,01224, 2500 = 0,01063 (USD); RoHS: Yes; Mount: Surface Mount; Case/Package: 0603; Case Code (Metric): 1608; Case Code (Imperial): 0603; Contact Plating: Matte,Tin; Min Operating Temperature: -55°C; Max Operating Temperature: 155°C; Packaging: Tape and Reel; Resistance: 10kR; Composition: Thin Film; Number of Terminations: 2; Features: Anti-Sulfur,Moisture Resistant; Length: 0.059inch; Height: 0.02inch; Width: 0.031inch; Radiation Hardening: No; Lead Free: Lead Free

## Sheet RS485.SchDoc: RS485
size A4; Revision: 1; SheetNumber: 7; SheetSize: A4
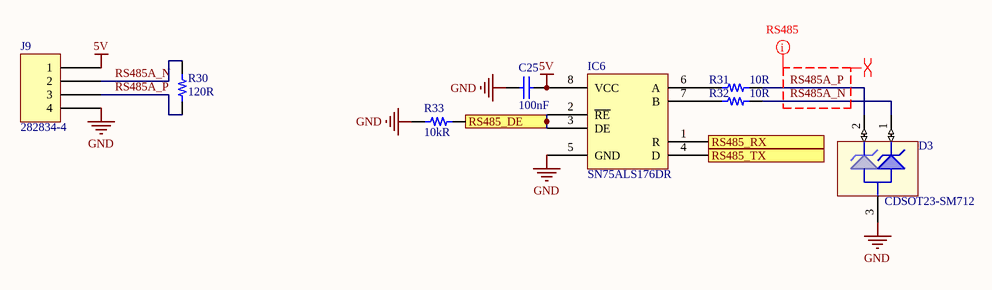
[diagram p4: RS485.SchDoc]

### Parts
C25  100nF  [CAP 0603/1608]
D3  CDSOT23-SM712  [sc70-3]
IC6  SN75ALS176DR  [TI SOIC-8 D]
J9  282834-4  [TE 282834-4]  (no BOM)
R30  120R  [RES 0603/1608]
R31  10R  [RES 0603/1608]
R32  10R  [RES 0603/1608]
R33  10kR  [RES 0603/1608]

### Ports
RS485_DE (in), RS485_RX (out), RS485_TX (in)

### Nets
5V: C25.2 IC6.8(VCC) J9.1
GND: C25.1 D3.3 IC6.5(GND) J9.4 R33.2
RS485A_N: D3.1 J9.2 R30.2 R32.2
RS485A_P: D3.2 J9.3 R30.1 R31.2
NetA1_11: IC6.4(D) ; port RS485_TX
NetA1_13: IC6.1(R) ; port RS485_RX
NetA1_15: IC6.2(~{RE}) IC6.3(DE) R33.1 ; port RS485_DE
NetIC6_6: IC6.6(A) R31.1
NetIC6_7: IC6.7(B) R32.1

### Layout directives
differential pair; differential pair class RS485A: RS485A_N, RS485A_P
net class RS485A: RS485A_N, RS485A_P

### Notes on the sheet
- Title:
- Size:
- Project:
- Revision:
- Sheet
- of
- Date:
- YıLDıZ IoT
- Elperek Mahallesi
- Saray Sokak, No:12
- SAKARYA / TURKEY
- File:

### Library data of the parts
C25 = Cap - Ceramic: Capacitor, Ceramic; Manufacturer: Samsung; Manufacturer Part Number: CL10A104KA8NNNC; Tolerance: 10%; Voltage Rating: 25V; Dielectric: X5R; Supplier 1: Digi-Key; Supplier Part Number 1: 1276-1857-1-ND; Stock 1: 978306; Pricing 1: 1 = 0,10000, 10 = 0,04600, 100 = 0,02070, 500 = 0,01478, 1000 = 0,01162 (USD); RoHS: Yes; Mount: Surface Mount; Case/Package: 0603; Case Code (Metric): 1608; Case Code (Imperial): 0603; Contact Plating: Tin; Min Operating Temperature: -55°C; Max Operating Temperature: 85°C; Package Quantity: 1; Packaging: Tape and Reel; Capacitance: 100nF; Voltage Rating (DC): 25V; Termination: Wraparound; Length: 0.063inch; Width: 0.031inch; Thickness: 0.035inch; Lead Free: Lead Free; ComponentLink1URL: http://www.samsungsem.com/kr/support/library/product-catalog/mlcc.jsp; ComponentLink1Description: http://www.samsungsem.com/kr/support/library/product-catalog/mlcc.jsp; Price: 0,1
D3 = TVS Array: Dual-line Transil™,  transient voltage suppressor (TVS); Manufacturer: Bourns; Direction: Bidirectional; Capacitance: 75pF; Max Surge Current: 30A; Number of Elements: 2; Reverse Breakdown Voltage: 13.3V; Polarity: Bidirectional,Unidirectional; Clamping Voltage: 26V; Max Power Dissipation: 600W; Working Voltage: 12V; Peak Pulse Power: 400W; Power Line Protection: No; Leakage Current: 20uA; ESD Protection: Yes; Peak Pulse Current: 17A; Test Current: 1mA; Element Configuration: Dual; Supplier 1: Digi-Key; Supplier Part Number 1: CDSOT23-SM712CT-ND; Manufacturer Part Number: CDSOT23-SM712; Stock 1: 158124; Pricing 1: 1 = 1,70000, 10 = 1,50900, 25 = 1,36280, 100 = 1,19240, 250 = 1,04636, 500 = 0,92468, 1000 = 0,73001 (USD); RoHS: Yes; Mount: Surface Mount; Case/Package: SOT-23; Number of Pins: 3; Contact Plating: Tin; Min Operating Temperature: -55°C; Max Operating Temperature: 150°C; Packaging: Tape and Reel; Package Quantity: 1; Number of Channels: 2; Breakdown Voltage: 13.3V; Termination: SMD/SMT; Number of Bidirectional Channels: 2; Reverse Standoff Voltage: 12V; Min Breakdown Voltage: 13.3V; Power Dissipation: 400W; Max Reverse Leakage Current: 20uA; Max Breakdown Voltage: 13.3V; Composition: Zener; Length: 3.04mm; Height: 1.11mm; Width: 0.055inch; Depth: 1.4mm; Radiation Hardening: No; REACH SVHC: No SVHC; ComponentLink1URL: http://www.farnell.com/datasheets/2645121.pdf; ComponentLink1Description: http://www.farnell.com/datasheets/2645121.pdf; ComponentLink2URL: http://www.bourns.com/docs/Product-Datasheets/CDSOT23-SM712.pdf; ComponentLink2Description: http://www.bourns.com/docs/Product-Datasheets/CDSOT23-SM712.pdf; ComponentLink3URL: https://www.bourns.com/docs/technical-documents/technical-library/circuit-protection/design-notes/bourns_rs485_evalboard4_design_note.pdf; ComponentLink3Description: https://www.bourns.com/docs/technical-documents/technical-library/circuit-protection/design-notes/bourns_rs485_evalboard4_design_note.pdf; ComponentLink4URL: http://www.farnell.com/datasheets/1670933.pdf; ComponentLink4Description: http://www.farnell.com/datasheets/1670933.pdf
IC6 = SN65HVD78DR: IC TRANSCEIVER HALF 1/1 8SOIC; Manufacturer: Texas Instruments; Data Rate: 35Mbps; Max Supply Voltage: 5.25V; Min Supply Voltage: 4.75V; Number of Drivers: 1; Operating Supply Current: 30mA; Simplex/Duplex: Half Duplex; ESD Protection: No; Operating Supply Voltage: 5V; ComponentLink1Description: Datasheet; ComponentLink1URL: http://www.ti.com/general/docs/suppproductinfo.tsp?distId=10&gotoUrl=http%3A%2F%2Fwww.ti.com%2Flit%2Fgpn%2Fsn65hvd78; ComponentLink2Description: DigiKey Link; ComponentLink2URL: http://digikey.com/product-detail/en/texas-instruments/SN65HVD78DR/296-36714-1-ND/4341340; ComponentLink3URL: https://datasheet.ciiva.com/26837/sn75als176dr-26837272.pdf?src-supplier=IIIC; ComponentLink3Description: https://datasheet.ciiva.com/26837/sn75als176dr-26837272.pdf?src-supplier=IIIC; ComponentLink4URL: https://datasheet.ciiva.com/14427/sn75als176a-14427911.pdf?src-supplier=Avnet; ComponentLink4Description: https://datasheet.ciiva.com/14427/sn75als176a-14427911.pdf?src-supplier=Avnet; ComponentLink5URL: https://datasheet.ciiva.com/1703/sn65als176-1703130.pdf?src-supplier=Digi-Key; ComponentLink5Description: https://datasheet.ciiva.com/1703/sn65als176-1703130.pdf?src-supplier=Digi-Key; ComponentLink6URL: https://datasheet.ciiva.com/1703/sn65als176-1703132.pdf?src-supplier=Digi-Key; ComponentLink6Description: https://datasheet.ciiva.com/1703/sn65als176-1703132.pdf?src-supplier=Digi-Key; ComponentLink7URL: https://datasheet.ciiva.com/1703/sn65als176-1703131.pdf?src-supplier=Digi-Key; ComponentLink7Description: https://datasheet.ciiva.com/1703/sn65als176-1703131.pdf?src-supplier=Digi-Key; ComponentLink8URL: https://datasheet.ciiva.com/48707/001048080-da-01-en-ic-dff-bus-tvr-s-sn75als176dr-soic-8-tid-48707959.pdf?src-supplier=Conrad; ComponentLink8Description: https://datasheet.ciiva.com/48707/001048080-da-01-en-ic-dff-bus-tvr-s-sn75als176dr-soic-8-tid-48707959.pdf?src-supplier=Conrad; Supplier 1: Digi-Key; Supplier Part Number 1: 296-14966-1-ND; Manufacturer Part Number: SN75ALS176DR; Stock 1: 2500; Pricing 1: 1 = 0,99000, 10 = 0,88500, 25 = 0,84000, 100 = 0,69000, 250 = 0,64500, 500 = 0,57000, 1000 = 0,45000 (USD); RoHS: Yes; Case/Package: D; Number of Pins: 8; Weight: 0.002561oz; Contact Plating: Gold; Min Operating Temperature: 0°C; Max Operating Temperature: 70°C; Logic Function: Transceiver; Number of Transceivers: 1; Max Supply Current: 30mA; Number of Receivers: 1; Number of Transmitters: 1; Nominal Supply Current: 30mA; Packaging: Tape and Reel; Package Quantity: 1; Length: 4.9mm; Height: 1.58mm; Width: 3.91mm; Radiation Hardening: No; Lead Free: Lead Free
J9 = 282834-4: TERM BLK 4P SIDE ENT 2.54MM PCB; Manufacturer: TE Connectivity AMP Connectors; Current: 10A; Mating Orientation: Horizontal with Board; Number of Levels: 1; Pitch: 0.100" (2.54mm); Positions Per Level: 4; Voltage: 150V; Wire Gauge: 16-30 AWG; Wire Termination: Screw - Rising Cage Clamp; Part Number: 282834-4; Color: Green; ComponentLink1Description: Datasheet; ComponentLink1URL: https://www.te.com/commerce/DocumentDelivery/DDEController?Action=srchrtrv&DocNm=282834&DocType=Customer+Drawing&DocLang=English; ComponentLink2Description: DigiKey Link; ComponentLink2URL: http://digikey.com/product-detail/en/te-connectivity-amp-connectors/282834-4/A98335-ND/1153265; LastUpdated: 15.01.2020 04:16:05; Lifecycle Status: Active; Minimum Order: 1; Mounting Type: Through Hole; Packaging: Bulk; Part Status: Active; Price: 2.68; Series: Buchanan; Supplier 1: DigiKey; Supplier Part Number 1: A98335-ND
R30 = Resistor_Chip: Ceramic, SMT Capacitor; Manufacturer: Susumu; Manufacturer Part Number: RR0816P-121-D; Power Rating: 63mW; Tolerance: 0.5%; Voltage Rating: 75V; Temperature Coefficient: 25ppm/°C; Supplier 1: Digi-Key; Supplier Part Number 1: RR08P120DCT-ND; Stock 1: 6882; Pricing 1: 1 = 0,11000, 10 = 0,09800, 100 = 0,03760, 1000 = 0,01654, 2500 = 0,01428 (USD); RoHS: Yes; Case/Package: 0603; Number of Pins: 2; Case Code (Metric): 1608; Case Code (Imperial): 0603; Min Operating Temperature: -55°C; Max Operating Temperature: 125°C; Package Quantity: 1; Resistance: 120R; Packaging: Tape and Reel; Composition: Thin Film; Number of Terminations: 2; Termination: SMD/SMT; Max Power Dissipation: 63mW; Voltage Rating (DC): 75V; Length: 0.063inch; Height: 0.02inch; Width: 0.032inch; Depth: 0.8mm; Height - Seated (Max): 0.02inch; REACH SVHC: Unknown; Lead Free: Lead Free; ComponentLink1URL: http://www.susumu.co.jp/common/pdf/n_catalog_partition05_en.pdf; ComponentLink1Description: http://www.susumu.co.jp/common/pdf/n_catalog_partition05_en.pdf; ComponentLink2URL: http://documents.rs-components.com/techlib://itc_doclist_GB.htm?stockno=4744287; ComponentLink2Description: http://documents.rs-components.com/techlib://itc_doclist_GB.htm?stockno=4744287
R31 R32 = Resistor_Chip: Ceramic, SMT Capacitor; Manufacturer: Rohm; Manufacturer Part Number: ESR03EZPJ100; Supplier 1: Digi-Key; Supplier Part Number 1: RHM10DCT-ND; Stock 1: 70067; Pricing 1: 1 = 0,10000, 10 = 0,08700, 100 = 0,03330, 1000 = 0,01464, 2500 = 0,01264 (USD); RoHS: Yes; Case/Package: 0603; Resistance: 10R
R33 = Resistor_Chip: as R35 on sheet Power; Supplier 1: Digi-Key; Supplier Part Number 1: RNCP0603FTD10K0CT-ND; Stock 1: 183083; Pricing 1: 1 = 0,10000, 10 = 0,06700, 100 = 0,02730, 1000 = 0,01224, 2500 = 0,01063 (USD); RoHS: Yes; Mount: Surface Mount; Case/Package: 0603; Case Code (Metric): 1608; Case Code (Imperial): 0603; Contact Plating: Matte,Tin; Min Operating Temperature: -55°C; Max Operating Temperature: 155°C; Packaging: Tape and Reel; Resistance: 10kR; Composition: Thin Film; Number of Terminations: 2; Features: Anti-Sulfur,Moisture Resistant; Length: 0.059inch; Height: 0.02inch; Width: 0.031inch; Radiation Hardening: No; Lead Free: Lead Free

## Sheet Expansion.SchDoc: Expansion
size A4; SheetNumber: 3; SheetSize: A4
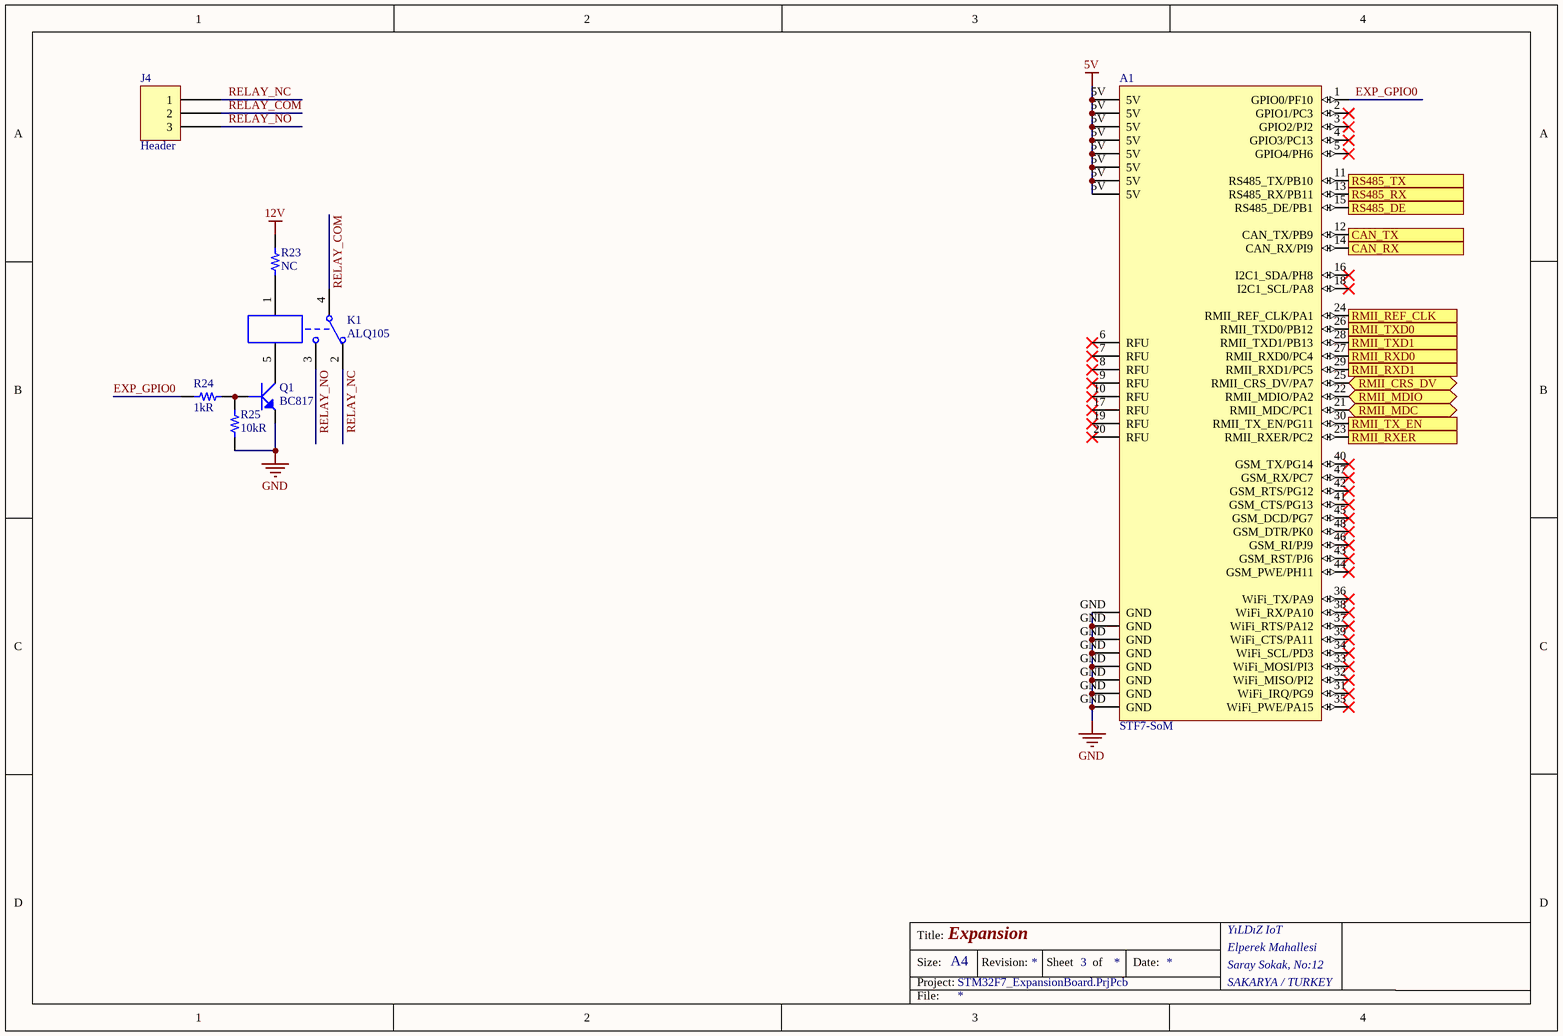
[diagram p5: Expansion.SchDoc]

### Parts
A1  STF7-SoM  [STF7-SoM]
J4  Header  [TE 282834-3]  (no BOM)
K1  ALQ105  [ALQ105]
Q1  BC817  [SOT23-3]  (no BOM)
R23  NC  [RES 0603/1608]  (no BOM)
R24  1kR  [RES 0603/1608]
R25  10kR  [RES 0603/1608]

### Ports
CAN_RX (in), CAN_TX (out), RMII_CRS_DV (bidir), RMII_MDC (bidir), RMII_MDIO (bidir), RMII_REF_CLK (in), RMII_RXD0 (out), RMII_RXD1 (out), RMII_RXER (out), RMII_TX_EN (in), RMII_TXD0 (in), RMII_TXD1 (in), RS485_DE (out), RS485_RX (in), RS485_TX (out)

### Nets
5V: A1.5V
12V: R23.2
GND: A1.GND Q1.2(E) R25.2
EXP_GPIO0: A1.1(GPIO0/PF10) R24.2
RELAY_COM: J4.2 K1.4(COM)
RELAY_NC: J4.1 K1.2(NC)
RELAY_NO: J4.3 K1.3(NO)
RMII_CRS_DV: A1.25(RMII_CRS_DV/PA7) ; port RMII_CRS_DV
RMII_MDC: A1.21(RMII_MDC/PC1) ; port RMII_MDC
RMII_MDIO: A1.22(RMII_MDIO/PA2) ; port RMII_MDIO
RMII_REF_CLK: A1.24(RMII_REF_CLK/PA1) ; port RMII_REF_CLK
RMII_RXD0: A1.27(RMII_RXD0/PC4) ; port RMII_RXD0
RMII_RXD1: A1.29(RMII_RXD1/PC5) ; port RMII_RXD1
RMII_RXER: A1.23(RMII_RXER/PC2) ; port RMII_RXER
RMII_TX_EN: A1.30(RMII_TX_EN/PG11) ; port RMII_TX_EN
RMII_TXD0: A1.26(RMII_TXD0/PB12) ; port RMII_TXD0
RMII_TXD1: A1.28(RMII_TXD1/PB13) ; port RMII_TXD1
NetA1_11: A1.11(RS485_TX/PB10) ; port RS485_TX
NetA1_12: A1.12(CAN_TX/PB9) ; port CAN_TX
NetA1_13: A1.13(RS485_RX/PB11) ; port RS485_RX
NetA1_14: A1.14(CAN_RX/PI9) ; port CAN_RX
NetA1_15: A1.15(RS485_DE/PB1) ; port RS485_DE
NetK1_1: K1.1(COIL) R23.1
NetK1_5: K1.5(COIL) Q1.3(C)
NetQ1_1: Q1.1(B) R24.1 R25.1

Not connected (* = marked no-connect by the designer): A1 2(GPIO1/PC3)* 3(GPIO2/PJ2)* 4(GPIO3/PC13)* 5(GPIO4/PH6)* 6(RFU)* 7(RFU)* 8(RFU)* 9(RFU)* 10(RFU)* 16(I2C1_SDA/PH8)* 17(RFU)* 18(I2C1_SCL/PA8)* 19(RFU)* 20(RFU)* 31(WiFi_IRQ/PG9)* 32(WiFi_MISO/PI2)* 33(WiFi_MOSI/PI3)* 34(WiFi_SCL/PD3)* 35(WiFi_PWE/PA15)* 36(WiFi_TX/PA9)* 37(WiFi_RTS/PA12)* 38(WiFi_RX/PA10)* 39(WiFi_CTS/PA11)* 40(GSM_TX/PG14)* 41(GSM_CTS/PG13)* 42(GSM_RTS/PG12)* 43(GSM_RST/PJ6)* 44(GSM_PWE/PH11)* 45(GSM_DCD/PG7)* 46(GSM_RI/PJ9)* 47(GSM_RX/PC7)* 48(GSM_DTR/PK0)*

### Notes on the sheet
- Title:
- Size:
- Project:
- Revision:
- Sheet
- of
- Date:
- YıLDıZ IoT
- Elperek Mahallesi
- Saray Sokak, No:12
- SAKARYA / TURKEY
- File:

### Library data of the parts
A1 = STF7-SoM: STM32F7 System On Module; Manufacturer Part Number: STF7-SoM
J4 = 3 Pin
K1 = Relay SPDT: Relay or Contactor; Manufacturer: Panasonic; Coil Voltage (DC): 5V; Coil Type: Non-Latching; Relay Type: General Purpose; Throw Configuration: SPDT; Coil Resistance: 62.5R; Coil Current: 80mA; Operate Time: 20ms; Coil Power: 400mW; Max Voltage Rating (AC): 250V; Contact Current Rating: 10A; Supplier 1: Digi-Key; Supplier Part Number 1: 255-3565-ND; Manufacturer Part Number: ALQ105; Stock 1: 8117; Pricing 1: 1 = 1,22000, 10 = 1,14800, 25 = 1,02000, 50 = 0,96900, 100 = 0,91800, 250 = 0,81600, 500 = 0,76500, 1000 = 0,71400, 5000 = 0,68850 (USD); RoHS: Yes; Number of Pins: 5; Weight: 7g; Contact Material: Silver; Min Operating Temperature: -40°C; Max Operating Temperature: 85°C; Termination: PC Pin; Release Time: 20ms; Package Quantity: 100; Packaging: Carton; Power Rating: 400mW; Power Consumption: 400mW; Voltage Rating (AC): 250V; Length: 20mm; Height: 16mm; Depth: 10mm; Width: 10mm; Lead Free: Lead Free; REACH SVHC: Unknown; ComponentLink1URL: http://www.mouser.com/ds/2/315/lq-catalog-1075796.pdf?src-supplier=Mouser; ComponentLink1Description: http://www.mouser.com/ds/2/315/lq-catalog-1075796.pdf?src-supplier=Mouser; ComponentLink2URL: http://www.farnell.com/datasheets/2245159.pdf?src-supplier=Farnell; ComponentLink2Description: http://www.farnell.com/datasheets/2245159.pdf?src-supplier=Farnell; ComponentLink3URL: http://components.arrow.com/part/dataview/0323_06571492?src-supplier=Arrow+Europe; ComponentLink3Description: http://components.arrow.com/part/dataview/0323_06571492?src-supplier=Arrow+Europe; ComponentLink4URL: http://www.alliedelec.com/m/d/b3e6213128df2023f710f2e9cac83292.pdf?src-supplier=Allied+Electronics; ComponentLink4Description: http://www.alliedelec.com/m/d/b3e6213128df2023f710f2e9cac83292.pdf?src-supplier=Allied+Electronics; ComponentLink5URL: https://media.digikey.com/pdf/Data%20Sheets/Panasonic%20Electric%20Works%20PDFs/ALQ(LQ)Relays_NewProdIntro.pdf?src-supplier=Digi-Key; ComponentLink5Description: https://media.digikey.com/pdf/Data%20Sheets/Panasonic%20Electric%20Works%20PDFs/ALQ(LQ)Relays_NewProdIntro.pdf?src-supplier=Digi-Key; ComponentLink6URL: http://www.farnell.com/datasheets/1972641.pdf?src-supplier=Element14; ComponentLink6Description: http://www.farnell.com/datasheets/1972641.pdf?src-supplier=Element14; ComponentLink7URL: http://www.farnell.com/datasheets/2245159.pdf?src-supplier=Newark; ComponentLink7Description: http://www.farnell.com/datasheets/2245159.pdf?src-supplier=Newark
Q1 = BC817: Transistor, BC817; Manufacturer: ON Semiconductor; Manufacturer Part Number: BC817-16LT1G; Transistor Type: NPN; Vce Saturation (Max) @ Ib, Ic: 700mV @ 50mA, 500mA; Current - Collector Cutoff (Max): 100nA (ICBO); DC Current Gain (hFE) (Min) @ Ic, Vce: 100 @ 100mA, 1V; Frequency - Transition: 100MHz; Supplier 1: Digi-Key; Supplier Part Number 1: BC817-16LT1GOSCT-ND; RoHS: RoHS Compliant; Category: Discrete Semiconductor Products; Stock 1: 46603; Pricing 1: 1=0.13, 10=0.118, 100=0.0642, 500=0.0395, 1000=0.02693 (USD); Packaging: Cut Tape (CT); Part Status: Active; Operating Temperature: -65°C ~ 150°C (TJ); Mounting Type: Surface Mount; Package / Case: TO-236-3, SC-59, SOT-23-3; Supplier Device Package: SOT-23-3 (TO-236); Base Part Number: BC817; ComponentLink1URL: http://www.onsemi.com/pub/Collateral/BC817-16LT1-D.PDF; ComponentLink1Description: http://www.onsemi.com/pub/Collateral/BC817-16LT1-D.PDF; Price: 0,13
R23 = Resistor_Chip: Ceramic, SMT Capacitor; Resistance: NC
R24 = Resistor_Chip: Ceramic, SMT Capacitor; Manufacturer: Rohm; Manufacturer Part Number: ESR03EZPJ102; Tolerance: 5%; Temperature Coefficient: 200ppm/°C; Max Power Dissipation: 250mW; Supplier 1: Digi-Key; Supplier Part Number 1: RHM1.0KDCT-ND; Stock 1: 148117; Pricing 1: 1 = 0,10000, 10 = 0,08300, 100 = 0,03180, 1000 = 0,01398, 2500 = 0,01207 (USD); RoHS: Yes; Case/Package: 0603; Case Code (Metric): 1608; Case Code (Imperial): 0603; Min Operating Temperature: -55°C; Max Operating Temperature: 155°C; Resistance: 1kR; Package Quantity: 1; Packaging: Tape and Reel; Composition: Thick Film; Number of Terminations: 2; Features: Automotive AEC-Q200; Length: 0.063inch; Height: 0.022inch; Width: 0.031inch; Lead Free: Lead Free; ComponentLink1URL: https://datasheet.ciiva.com/2469/esr-2469603.pdf?src-supplier=Digi-Key; ComponentLink1Description: https://datasheet.ciiva.com/2469/esr-2469603.pdf?src-supplier=Digi-Key; ComponentLink2URL: https://datasheet.ciiva.com/2469/esr-2469604.pdf?src-supplier=Digi-Key; ComponentLink2Description: https://datasheet.ciiva.com/2469/esr-2469604.pdf?src-supplier=Digi-Key; ComponentLink3URL: https://datasheet.ciiva.com/2469/esr-2469605.pdf?src-supplier=Digi-Key; ComponentLink3Description: https://datasheet.ciiva.com/2469/esr-2469605.pdf?src-supplier=Digi-Key
R25 = Resistor_Chip: as R35 on sheet Power; Supplier 1: Digi-Key; Supplier Part Number 1: RNCP0603FTD10K0CT-ND; Stock 1: 183083; Pricing 1: 1 = 0,10000, 10 = 0,06700, 100 = 0,02730, 1000 = 0,01224, 2500 = 0,01063 (USD); RoHS: Yes; Mount: Surface Mount; Case/Package: 0603; Case Code (Metric): 1608; Case Code (Imperial): 0603; Contact Plating: Matte,Tin; Min Operating Temperature: -55°C; Max Operating Temperature: 155°C; Packaging: Tape and Reel; Resistance: 10kR; Composition: Thin Film; Number of Terminations: 2; Features: Anti-Sulfur,Moisture Resistant; Length: 0.059inch; Height: 0.02inch; Width: 0.031inch; Radiation Hardening: No; Lead Free: Lead Free

## Nets that join several sheets
3v: CAN (C1.2 C2.2 IC1.5 R2.1), Ethernet (16 pins), Power (C20.2 IC5.4 R34.2)
5V: CAN (C3.2 C4.2 IC1.3 J1.1), Power (8 pins), RS485 (C25.2 IC6.8 J9.1), Expansion (A1.5V)
12V: Power (6 pins), Expansion (R23.2)
GND: CAN (9 pins), Ethernet (17 pins), Power (16 pins), RS485 (5 pins), Expansion (A1.GND Q1.2 R25.2)
NetA1_11: RS485 (IC6.4), Expansion (A1.11)
NetA1_12: CAN (IC1.1), Expansion (A1.12)
NetA1_13: RS485 (IC6.1), Expansion (A1.13)
NetA1_14: CAN (IC1.4), Expansion (A1.14)
NetA1_15: RS485 (IC6.2 IC6.3 R33.1), Expansion (A1.15)
RMII_CRS_DV: Ethernet (R12.2), Expansion (A1.25)
RMII_MDC: Ethernet (IC2.13), Expansion (A1.21)
RMII_MDIO: Ethernet (IC2.12 R8.2), Expansion (A1.22)
RMII_REF_CLK: Ethernet (IC2.14 R9.2), Expansion (A1.24)
RMII_RXD0: Ethernet (R10.2), Expansion (A1.27)
RMII_RXD1: Ethernet (R11.2), Expansion (A1.29)
RMII_RXER: Ethernet (IC2.10 R6.2), Expansion (A1.23)
RMII_TX_EN: Ethernet (IC2.16), Expansion (A1.30)
RMII_TXD0: Ethernet (IC2.17), Expansion (A1.26)
RMII_TXD1: Ethernet (IC2.18), Expansion (A1.28)